# Altium schematic sheet 06.other.SchDoc
size A4
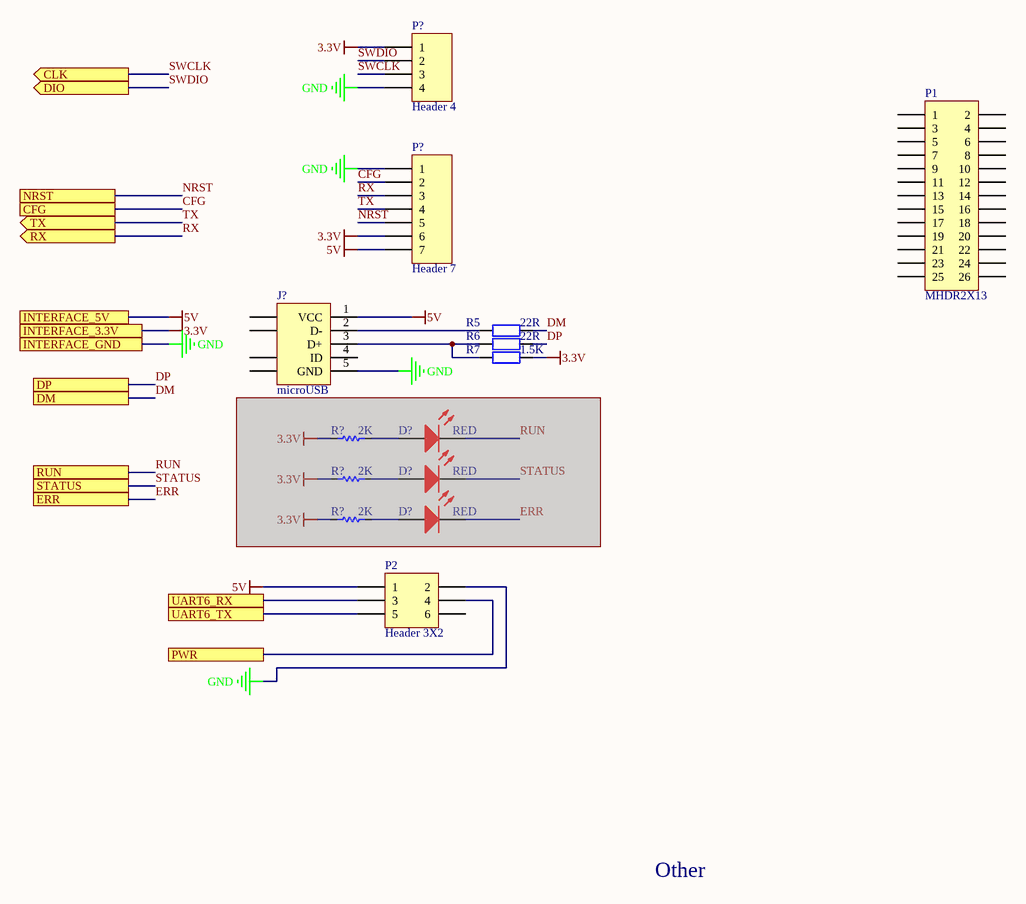
[diagram p0: 06.other.SchDoc]

## Parts
(Parts that share a designator on the sheet are numbered #1, #2 ... from top to bottom, then left to right.)
D?#1  RED  [0603led]  (masked out: inside a compile mask, not in the netlist)
D?#2  RED  [0603led]  (masked out: inside a compile mask, not in the netlist)
D?#3  RED  [0603led]  (masked out: inside a compile mask, not in the netlist)
J?  microUSB  [USB-Micro-DIP]
P1  MHDR2X13  [MHDR2X13]
P2  Header 3X2  [HDR2X3]
P?#1  Header 4  [HDR1X4]
P?#2  Header 7  [HDR1X7]
R5  value 22R  [0603R]  (hidden comment: Res2)
R6  value 22R  [0603R]  (hidden comment: Res2)
R7  value 1.5K  [0603R]  (hidden comment: Res2)
R?#1  2K  [0603R]  (masked out: inside a compile mask, not in the netlist)
R?#2  2K  [0603R]  (masked out: inside a compile mask, not in the netlist)
R?#3  2K  [0603R]  (masked out: inside a compile mask, not in the netlist)

## Ports
CFG, CLK (out), DIO (out), DM, DP, ERR, INTERFACE_3.3V, INTERFACE_5V, INTERFACE_GND, NRST, PWR, RUN, RX (out), STATUS, TX (out), UART6_RX, UART6_TX

## Nets
3.3V: P?#1.1 P?#2.6 R7.1 ; port INTERFACE_3.3V
5V: J?.1(VCC) P2.1 P?#2.7 ; port INTERFACE_5V
GND: J?.5(GND) P2.2 P?#1.4 P?#2.1 ; port INTERFACE_GND
CFG: P?#2.2 ; port CFG
DM: R5.1 ; port DM
DP: R6.1 ; port DP
ERR: port ERR
NRST: P?#2.5 ; port NRST
PWR: P2.4 ; port PWR
RUN: port RUN
RX: P?#2.3 ; port RX
STATUS: port STATUS
SWCLK: P?#1.3 ; port CLK
SWDIO: P?#1.2 ; port DIO
TX: P?#2.4 ; port TX
UART6_RX: P2.3 ; port UART6_RX
UART6_TX: P2.5 ; port UART6_TX
NetJ?_2: J?.2(D-) R5.2
NetJ?_3: J?.3(D+) R6.2 R7.2

Not connected (* = marked no-connect by the designer): J? 4(ID) 6 7 8 9; P1 1 2 3 4 5 6 7 8 9 10 11 12 13 14 15 16 17 18 19 20 21 22 23 24 25 26; P2 6

## Notes on the sheet
- Other
- #
- 日期
- 描述
- DESIGN BY
- 设计人员
- 设计日期
- 图纸名称
- 图纸描述
- EasyLinker Develop Team
- 审核人员
- 审核日期
- 产品名称
- 产品型号
- 图纸版本
- /
- A4

## Library data of the parts
D?#1-D?#3 = LED_RED: Typical RED; Published: 8-Jun-2000; LatestRevisionDate: 17-Jul-2002; LatestRevisionNote: Re-released for DXP Platform.; PackageVersion: Feb-2002; PackageReference: 3.2X1.6X1.1; Publisher: Altium Limited; PackageDescription: SM LED; 2 Flat Leads
J? = USB-micro
P1 = MHDR2X13: Header, 13-Pin, Dual row; LatestRevisionDate: 17-Jul-2002; LatestRevisionNote: Re-released for DXP Platform.; Publisher: Altium Limited
P2 = Header 3X2: Header, 3-Pin, Dual row; LatestRevisionDate: 17-Jul-2002; LatestRevisionNote: Re-released for DXP Platform.; Publisher: Altium Limited
P?#1 = Header 4: Header, 4-Pin; LatestRevisionDate: 17-Jul-2002; LatestRevisionNote: Re-released for DXP Platform.; Publisher: Altium Limited
P?#2 = Header 7: Header, 7-Pin; LatestRevisionDate: 17-Jul-2002; LatestRevisionNote: Re-released for DXP Platform.; Publisher: Altium Limited
R5-R7 = Res2: Resistor; Published: 8-Jun-2000; LatestRevisionDate: 17-Jul-2002; LatestRevisionNote: Re-released for DXP Platform.; PackageReference: AXIAL-0.4; Publisher: Altium Limited; PackageDescription: Axial Device, Thru-Hole; 2 Leads; 0.4 in Pin Spacing
R?#1-R?#3 = Res1: Resistor; Published: 8-Jun-2000; LatestRevisionDate: 17-Jul-2002; LatestRevisionNote: Re-released for DXP Platform.; PackageReference: AXIAL-0.3; Publisher: Altium Limited; PackageDescription: Axial Device, Thru-Hole; 2 Leads; 0.3 in Pin Spacing; Value: 2K